# EAGLE design sirin-clone-mcu (EAGLE 9.3.1)
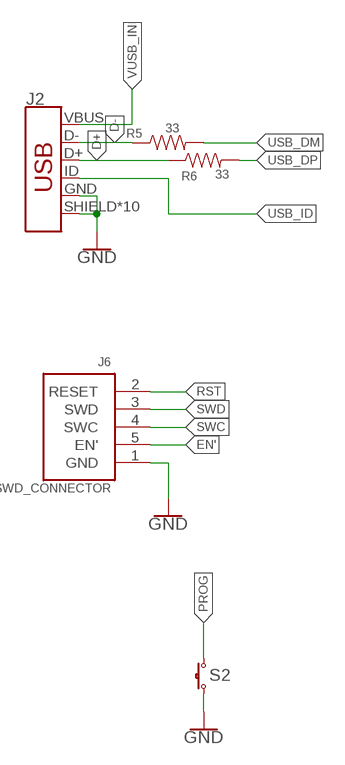
[diagram p0: schematic, sheet 1, part 1 of 2]
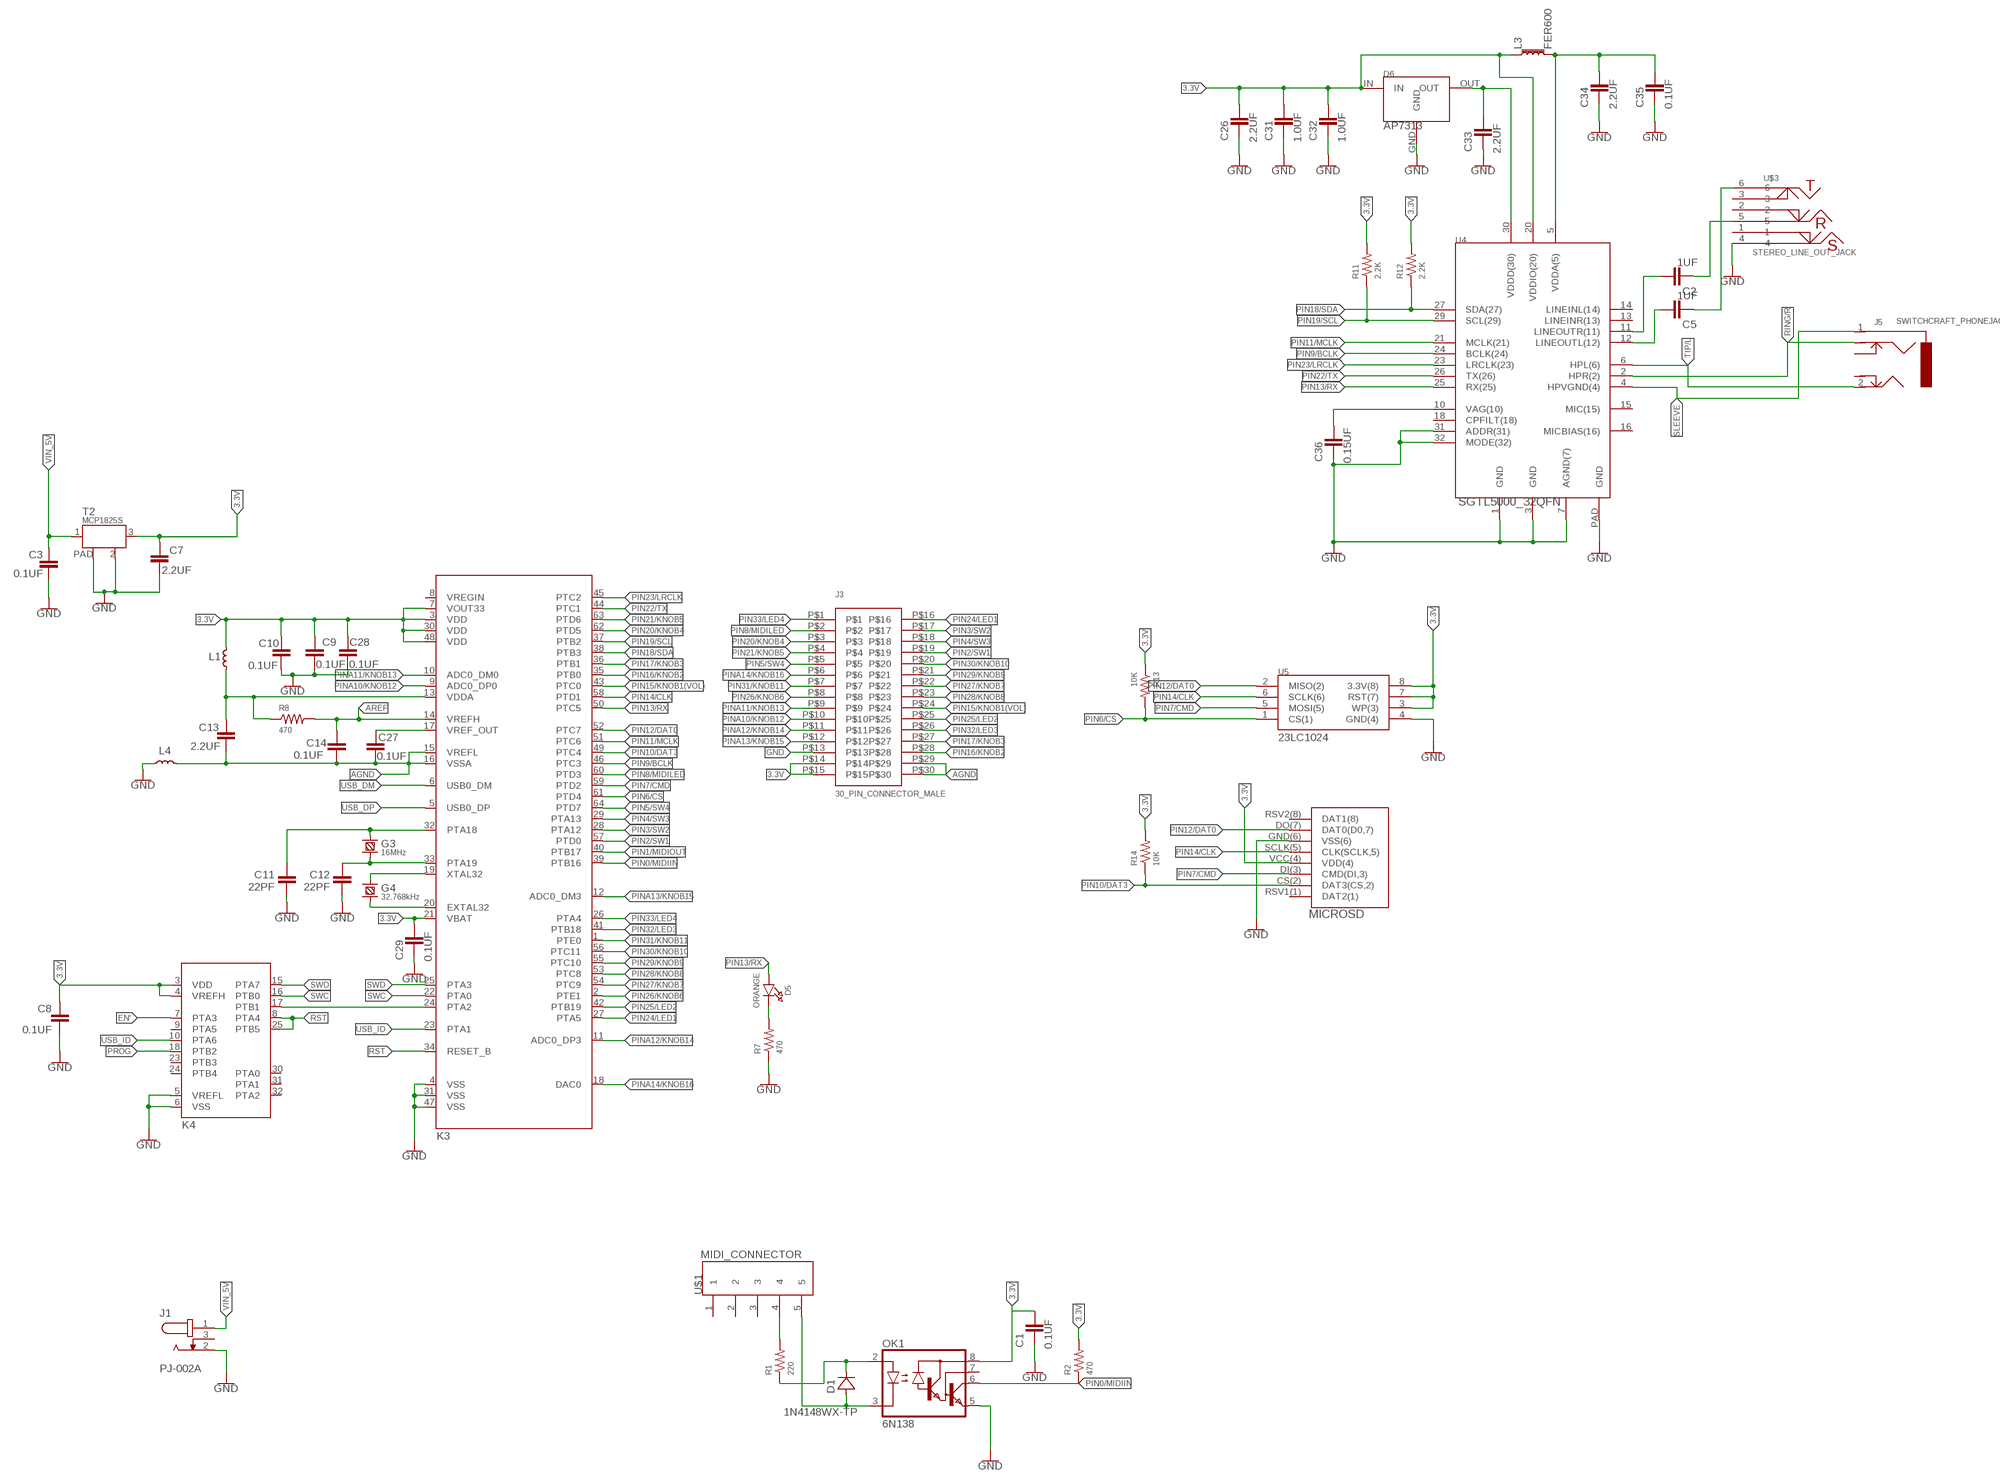
[diagram p1: schematic, sheet 1, part 2 of 2]

## Parts
C1  0.1UF  [C_0805]
C2  1UF  [C_0805]
C3  0.1UF  [C_0805]
C5  1UF  [C_0805]
C7  2.2UF  [C_0805]
C8  0.1UF  [C_0805]
C9  0.1UF  [C_0805]
C10  0.1UF  [C_0805]
C11  22PF  [C_0805]
C12  22PF  [C_0805]
C13  2.2UF  [C_0805]
C14  0.1UF  [C_0805]
C26  2.2UF  [C_0805]
C27  0.1UF  [C_0805]
C28  0.1UF  [C_0805]
C29  0.1UF  [C_0805]
C31  1.0UF  [C_0805]
C32  1.0UF  [C_0805]
C33  2.2UF  [C_0805]
C34  2.2UF  [C_0805]
C35  0.1UF  [C_0805]
C36  0.15UF  [C_0805]
D1  1N4148WX-TP  [SOD323]
D5  ORANGE  LED_ORANGE0805  [CHIPLED_0805]
D6  AP7313  [SOT23-3]
G3  16MHz  CRYSTAL-HC49US  [HC49US]
G4  32.768kHz  CRYSTAL-TC26H  [TC26H]
J1  PJ-002A  [CUI_PJ-002A]
J2  USB_MICRO-B_HALF_PTH_MILL  [USB-MICROB-PTH-MILL]
J3  30_PIN_CONNECTOR_MALE  [MOLEX_30PINCONNECTOR_2MM]
J5  SWITCHCRAFT_PHONEJACK  [STEREO_JACK_2SWITCH]
J6  SWD_CONNECTOR  [1X5HEADER]
K3  MK20DX256VLH7  [LQFP64-05]
K4  MKL04Z32VLC4  [LQFP32-08]
L1  FERRITE600_TEENSY  [L0603]
L3  FER600  FERRITE600  [0805]
L4  FERRITE600_TEENSY  [L0603]
OK1  6N138  [DIP8]
R1  220  220OHM  [0805]
R2  470  470OHM  [0805]
R5  33  33OHM  [0805]
R6  33  33OHM  [0805]
R7  470  470OHM  [0805]
R8  470  470OHM  [0805]
R11  2.2K  2.2KOHM  [0805]
R12  2.2K  2.2KOHM  [0805]
R13  10K  10KOHM  [0805]
R14  10K  10KOHM  [0805]
S2  TACT_SWITCH  [SWITCH_PTS820]
T2  MCP1825S  LDO  [SOT-223]
U4  SGTL5000_32QFN  [QFN-32-5MM]
U5  23LC1024  [TSSOP8]
U$1  MIDI_CONNECTOR  [DIN_SDS_50J]
U$3  STEREO_LINE_OUT_JACK  [AMPHENOL_STEREO_JACK]
U$6  MICROSD  [MICRO-SD-SOCKET]

## Nets
3.3V: C1.+ C7.+ C8.+ C9.+ C10.+ C26.+ C28.+ C29.+ C31.+ C32.+ D6.IN J3.P$14 J3.P$15 K3.3(VDD) K3.7(VOUT33) K3.21(VBAT) K3.30(VDD) K3.48(VDD) K4.3(VDD) K4.4(VREFH) L1.2 L3.1 OK1.8(VCC) R2.2 R11.2 R12.2 R13.1 R14.2 T2.3(OUT) U4.20(VDDIO(20)) U5.3(WP(3)) U5.7(RST(7)) U5.8(3.3V(8)) U$6.VCC(4)(VDD(4))
AGND: C13.- C14.- C27.- J3.P$29 J3.P$30 K3.15(VREFL) K3.16(VSSA) L4.2
AREF: C14.+ K3.14(VREFH) R8.2
D+: J2.D+ R6.1
D-: J2.D- R5.1
EN': J6.5(EN') K4.7(PTA3)
GND: C1.- C3.- C7.- C8.- C9.- C10.- C11.- C12.- C26.- C28.- C29.- C31.- C32.- C33.- C34.- C35.- C36.- D6.GND J1.2 J2.GND J2.SHIELD J2.SHIELD2(SHIELD) J2.SHIELD3(SHIELD) J2.SHIELD4(SHIELD) J2.SHIELD5(SHIELD) J2.SHIELD6(SHIELD) J2.SHIELD7(SHIELD) J2.SHIELD8(SHIELD) J2.SHIELD9(SHIELD) J2.SHIELD10(SHIELD) J3.P$13 J6.1(GND) K3.4(VSS) K3.31(VSS) K3.47(VSS) K4.5(VREFL) K4.6(VSS) L4.1 OK1.5(GND) R7.1 S2.2 T2.2(GND) T2.PAD U4.1(GND) U4.3(GND) U4.7(AGND(7)) U4.31(ADDR(31)) U4.32(MODE(32)) U4.PAD(GND) U5.4(GND(4)) U$3.4 U$6.GND(6)(VSS(6))
N$1: D1.A OK1.3(C) U$1.5
N$2: R1.2 U$1.4
N$3: D1.C OK1.2(A) R1.1
N$5: C5.+ U4.12(LINEOUTL(12))
N$6: C2.+ U4.11(LINEOUTR(11))
N$7: C2.- U$3.5
N$8: K3.24(PTA2) K4.17(PTB1)
N$9: D5.C R7.2
N$10: G4.1 K3.20(EXTAL32)
N$11: G4.2 K3.19(XTAL32)
N$12: C12.+ G3.2 K3.33(PTA19)
N$13: C11.+ G3.1 K3.32(PTA18)
N$14: C13.+ K3.13(VDDA) L1.1 R8.1
N$15: C27.+ K3.17(VREF_OUT)
N$16: C5.- U$3.6
N$19: C36.+ U4.10(VAG(10))
N$20: C33.+ D6.OUT U4.30(VDDD(30))
N$21: C34.+ C35.+ L3.2 U4.5(VDDA(5))
PIN0/MIDIIN: K3.39(PTB16) OK1.6(VO) R2.1
PIN1/MIDIOUT: K3.40(PTB17)
PIN2/SW1: J3.P$19 K3.57(PTD0)
PIN3/SW2: J3.P$17 K3.28(PTA12)
PIN4/SW3: J3.P$18 K3.29(PTA13)
PIN5/SW4: J3.P$5 K3.64(PTD7)
PIN6/CS: K3.61(PTD4) R13.2 U5.1(CS(1))
PIN7/CMD: K3.59(PTD2) U5.5(MOSI(5)) U$6.DI(3)(CMD(DI,3))
PIN8/MIDILED: J3.P$2 K3.60(PTD3)
PIN9/BCLK: K3.46(PTC3) U4.24(BCLK(24))
PIN10/DAT3: K3.49(PTC4) R14.1 U$6.CS(2)(DAT3(CS,2))
PIN11/MCLK: K3.51(PTC6) U4.21(MCLK(21))
PIN12/DAT0: K3.52(PTC7) U5.2(MISO(2)) U$6.DO(7)(DAT0(D0,7))
PIN13/RX: D5.A K3.50(PTC5) U4.25(RX(25))
PIN14/CLK: K3.58(PTD1) U5.6(SCLK(6)) U$6.SCLK(5)(CLK(SCLK,5))
PIN15/KNOB1(VOL): J3.P$24 K3.43(PTC0)
PIN16/KNOB2: J3.P$28 K3.35(PTB0)
PIN17/KNOB3: J3.P$27 K3.36(PTB1)
PIN18/SDA: K3.38(PTB3) R12.1 U4.27(SDA(27))
PIN19/SCL: K3.37(PTB2) R11.1 U4.29(SCL(29))
PIN20/KNOB4: J3.P$3 K3.62(PTD5)
PIN21/KNOB5: J3.P$4 K3.63(PTD6)
PIN22/TX: K3.44(PTC1) U4.26(TX(26))
PIN23/LRCLK: K3.45(PTC2) U4.23(LRCLK(23))
PIN24/LED1: J3.P$16 K3.27(PTA5)
PIN25/LED2: J3.P$25 K3.42(PTB19)
PIN26/KNOB6: J3.P$8 K3.2(PTE1)
PIN27/KNOB7: J3.P$22 K3.54(PTC9)
PIN28/KNOB8: J3.P$23 K3.53(PTC8)
PIN29/KNOB9: J3.P$21 K3.55(PTC10)
PIN30/KNOB10: J3.P$20 K3.56(PTC11)
PIN31/KNOB11: J3.P$7 K3.1(PTE0)
PIN32/LED3: J3.P$26 K3.41(PTB18)
PIN33/LED4: J3.P$1 K3.26(PTA4)
PINA10/KNOB12: J3.P$10 K3.9(ADC0_DP0)
PINA11/KNOB13: J3.P$9 K3.10(ADC0_DM0)
PINA12/KNOB14: J3.P$11 K3.11(ADC0_DP3)
PINA13/KNOB15: J3.P$12 K3.12(ADC0_DM3)
PINA14/KNOB16: J3.P$6 K3.18(DAC0)
PROG: K4.18(PTB2) S2.1
RING/R: J5.3(RING(3)) U4.2(HPR(2))
RST: J6.2(RESET) K3.34(RESET_B) K4.8(PTA4) K4.25(PTB5)
SLEEVE [HPGND]: J5.1(SLEEVE(1)) U4.4(HPVGND(4))
SWC: J6.4(SWC) K3.22(PTA0) K4.16(PTB0)
SWD: J6.3(SWD) K3.25(PTA3) K4.15(PTA7)
TIP/L: J5.2(TIP(2)) U4.6(HPL(6))
USB_DM: K3.6(USB0_DM) R5.2
USB_DP: K3.5(USB0_DP) R6.2
USB_ID: J2.ID K3.23(PTA1) K4.10(PTA6)
VIN_5V: C3.+ J1.1 T2.1(IN)
VUSB_IN: J2.VBUS
Unconnected: J1.3 J5.4(TIPSWITCH(4)) J5.5(RINGSWITCH(5)) K3.8(VREGIN) K4.9(PTA5) K4.23(PTB3) K4.24(PTB4) K4.30(PTA0) K4.31(PTA1) K4.32(PTA2) OK1.7(VB) U4.13(LINEINR(13)) U4.14(LINEINL(14)) U4.15(MIC(15)) U4.16(MICBIAS(16)) U4.18(CPFILT(18)) U$1.1 U$1.2 U$1.3 U$3.1 U$3.2 U$3.3 U$6.RSV1(1)(DAT2(1)) U$6.RSV2(8)(DAT1(8))

## Library data of the parts
C1 = sirin-clone-library:0.1UF: https://www.digikey.com/product-detail/en/kemet/C0805C104Z3VACTU/399-9158-1-ND/3522676
C2 C5 = sirin-clone-library:1UF: https://www.digikey.com/product-detail/en/kemet/C0805C104Z3VACTU/399-9158-1-ND/3522676
C3 C8-C10 C14 C27-C29 C35 = moon-germs-v1_main:0.1UF: https://www.digikey.com/product-detail/en/kemet/C0805C104Z3VACTU/399-9158-1-ND/3522676
C7 C13 C26 C33 C34 = moon-germs-v1_main:2.2UF: https://www.digikey.com/product-detail/en/samsung-electro-mechanics/CL21B105KAFNNNE/1276-1066-1-ND/3889152
C11 C12 = moon-germs-v1_main:22PF
C31 C32 = moon-germs-v1_main:1.0UF: https://www.digikey.com/product-detail/en/samsung-electro-mechanics/CL21B105KAFNNNE/1276-1066-1-ND/3889152
C36 = moon-germs-v1_main:0.15UF: https://www.digikey.com/product-detail/en/wurth-electronics-inc/885012207073/732-7667-1-ND/5454294
D1 = sirin-clone-library:1N4148WX-TP: https://www.digikey.com/product-detail/en/micro-commercial-co/1N4148WX-TP/1N4148WXTPMSCT-ND/717312
D5 = moon-germs-v1_main:LED_ORANGE: LED 0603 - 0603 Surface Mount Package 2mA: Green LED - Low Power (3.9mcd, 2ma, 1.7Vf) - Digikey: 475-2709-2-ND Orange LED - Low Power (9.8mcd, 2ma, 1.8Vf) - Digikey: 475-1194-2-ND Red LED - Low Power (5mcd, 2ma, 1.8Vf) - Digikey: 475-1195-2-ND Yellow LED - Low Power (7mcd, 2ma, 1.8Vf) - Digikey: 475-1196-2-ND 5mA: Blue LED - Low Power (17mcd, 5ma, 2.9Vf) - Digikey: LNJ937W8CRACT-ND 0805 - 0805 Surface Mount Package 2mA: Red LED (8.8mcd, 2mA, 1.8Vf, Clear) - Low Power [Digikey: 475-2510-1-ND] Green LED (5mcd, 2mA, 1.8Vf, Clear) - Low Power [Digikey: 475-2730-1-ND] Yellow LED (11.3mcd, 2mA, 1.8Vf, Clear) - Low Power [Digikey: 475-2555-1-ND] 20mA: Red LED (104mcd, 20mA, Diffused) - LS R976 [Digikey: 475-1278-6-ND] Red LED (12mcd, 20mA, 2.0Vf, Clear) - APT2012EC [Digikey: 754-1128-1-ND] Green LED (15mcd, 20mA, 2.2Vf, Clear) - APT2012GC [Digikey: 754-1131-1-ND] Orange LED (160mcd, 20mA, 2.1Vf, Clear) - APT2012SECK [Digikey: 754-1130-1-ND] 1206 - 1206 Surface Mount Package Green LED (26mcd, 20mA, Diffused) - LG N971 [Digikey: 475-1407-6-ND] Red LED (15mcd, 20mA, Diffused) - LH N974 [Digikey: 475-1416-6-ND] Cree - Cree High-Power Surface Mount LEDs XPEBWT-L1-0000-00D50 - White 111lm 350mA 2.9Vf 6200K 110° XTEAWT-00-0000-00000LEE3 - White 114lm 350mA 2.85Vf 5000K 115° Everlight - Everlight 45-21 Series Surface Mount LEDs 45-21/QK2C-B2832AC2CB2/2T - Warm White 2000mcd 20mA 3.25Vf 3050K 120° 45-21/LK2C-B38452C4CB2/2T - Nuetral White 2000mcd 20mA 3.25Vf 4150K 120° 45-21/LK2C-B50634C6CB2/2T - Cold White 2200mcd 20mA 3.25Vf 5650K 120° PLCC2 Reverse Mount LS T77K-J1L2-1-0-2-R18-Z - Red 11.25mcd 2mA 1.8Vf 630nm 120° LO T77K-L1M2-24-Z - Orange 19.6mcd 2mA 1.8Vf 606nm 120° LY T77K-K2M1-26-Z - Yellow 15.7mcd 2mA 1.8Vf 587nm 120°
D6 = moon-germs-v1:AP7313: https://www.digikey.com/product-detail/en/diodes-incorporated/AP7313-33SRG-7/AP7313-33SRG-7DICT-ND/2270841
G3 = moon-germs-v1_main:CRYSTAL-; DESC: 16MHz / 18pF / 10ppm; MF: ABRACON; MPN: ABL-16.000MHz-B1U; OC_MOUSER: 815-ABL-16-B1U; PACKAGE: HC-49US; TYPE: Crystal
G4 = moon-germs-v1_main:CRYSTAL-; DESC: 32.768kHz / 12.5pF / 20ppm; MF: Citizen FineDevice; MPN: CFS206-32.768KDZF-UB; OC_MOUSER: 695-CFS206-327KF-U; PACKAGE: TC-26H; TYPE: Crystal
J1 = sirin-clone-library:PJ-002A: 2.0 mm Center Pin, 2.5 A, Right Angle, Through Hole, Dc Power Jack Connector; MANUFACTURER: CUI INC; STANDARD: Manufacturer recommendations
J2 = sirin-clone-library:USB_MICRO-B: USB Type Micro-B Connector Male/female and PTH/SMT variants SparkFun Products: SparkFun microB USB Breakout <https://www.sparkfun.com/products/12035> SparkFun USB microB Plug Breakout <https://www.sparkfun.com/products/10031> SparkFun ESP8266 Thing <https://www.sparkfun.com/products/13231>; PROD_ID: CONN-13711
J3 = sirin-clone-library:30_PIN_CONNECTOR_MALE: https://www.digikey.com/product-detail/en/amphenol-icc-fci/57202-G52-15LF/609-2628-ND/1090157
J5 = moon-germs-v1_main:SWITCHCRAFT_PHONEJACK
J6 = moon-germs-v1_main:SWD_CONNECTOR
K3 = moon-germs-v1_main:MK20DX256VLH7; DESC: MK20DX256VLH7; MF: NXP; MPN: MK20DX256VLH7; OC_MOUSER: 841-MK20DX256VLH7; PACKAGE: LQFP-64; TYPE: Microcontroller
K4 = moon-germs-v1_main:MKL04Z32VLC4; DESC: MKL04Z32VLC4 (preprogrammed); MF: PJRC; MPN: IC_MKL04Z32_TQFP32; PACKAGE: LQFP-32; TYPE: Microcontroller
L1 L4 = moon-germs-v1_main:FERRITE600_TEENSY; DESC: 600R / 100MHz; MF: Murata Electronics; MPN: BLM18AG601SN1D; OC_MOUSER: 81-BLM11A601S; PACKAGE: 0603; TYPE: Ferrite
L3 = moon-germs-v1_main:FERRITE600: https://www.digikey.com/product-detail/en/tdk-corporation/MPZ2012S601AT000/445-2206-1-ND/765104
OK1 = sirin-clone-library:6N138: https://www.digikey.com/product-detail/en/lite-on-inc/6N138S/160-1797-ND/1969181
R1 = sirin-clone-library:220OHM
R2 = sirin-clone-library:470OHM
R5 R6 = moon-germs-v1_main:33OHM
R7 R8 = moon-germs-v1_main:470OHM
R11 R12 = moon-germs-v1_main:2.2KOHM: https://www.digikey.com/product-detail/en/yageo/RC0805FR-072K2L/311-2.20KCRCT-ND/730623
R13 R14 = moon-germs-v1_main:10KOHM
S2 = moon-germs-v1_main:TACT_SWITCH
T2 = moon-germs-v1_main:LDO; DESC: 3.3V 500mA; MF: Microchip Technology; MPN: MCP1825S-3302E/DB; OC_MOUSER: 579-MCP1825S-3302EDB; PACKAGE: SOT-223-3; TYPE: Voltage regulator
U4 = moon-germs-v1_main:SGTL5000_32QFN: https://www.digikey.com/product-detail/en/nxp-usa-inc/SGTL5000XNAA3R2/SGTL5000XNAA3R2TR-ND/2186898
U5 = moon-germs-v1_main:23LC1024: https://www.digikey.com/product-detail/en/microchip-technology/23LC1024T-I-ST/23LC1024T-I-STCT-ND/5818676
U$1 = sirin-clone-library:MIDI_CONNECTOR: https://www.digikey.com/product-detail/en/cui-inc/SDS-50J/CP-2350-ND/97033
U$3 = sirin-clone-library:STEREO_LINE_OUT_JACK
U$6 = moon-germs-v1_main:MICROSD

## Net classes
1 HPGND: width 0.254 mm

## Board
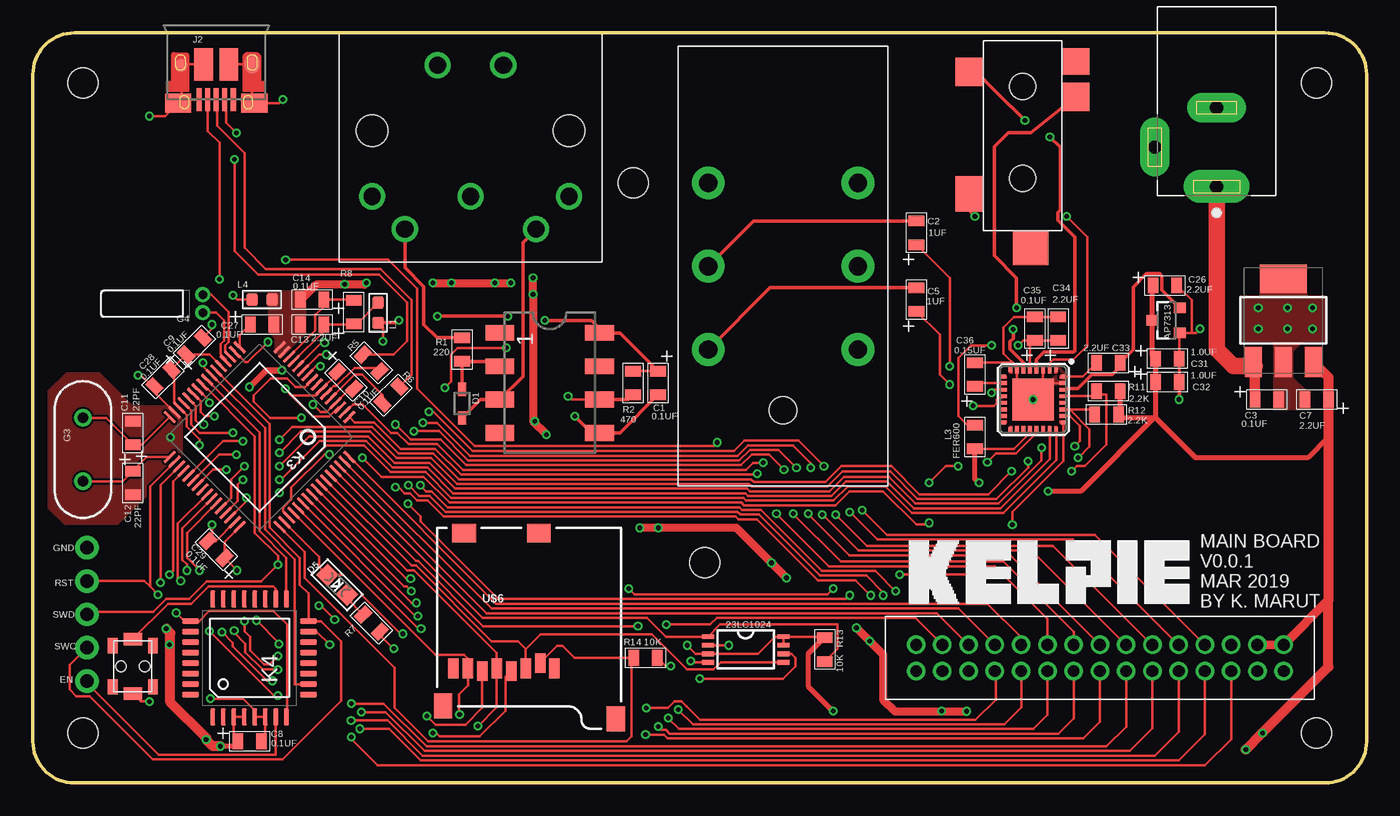
[diagram p2: board, top side]
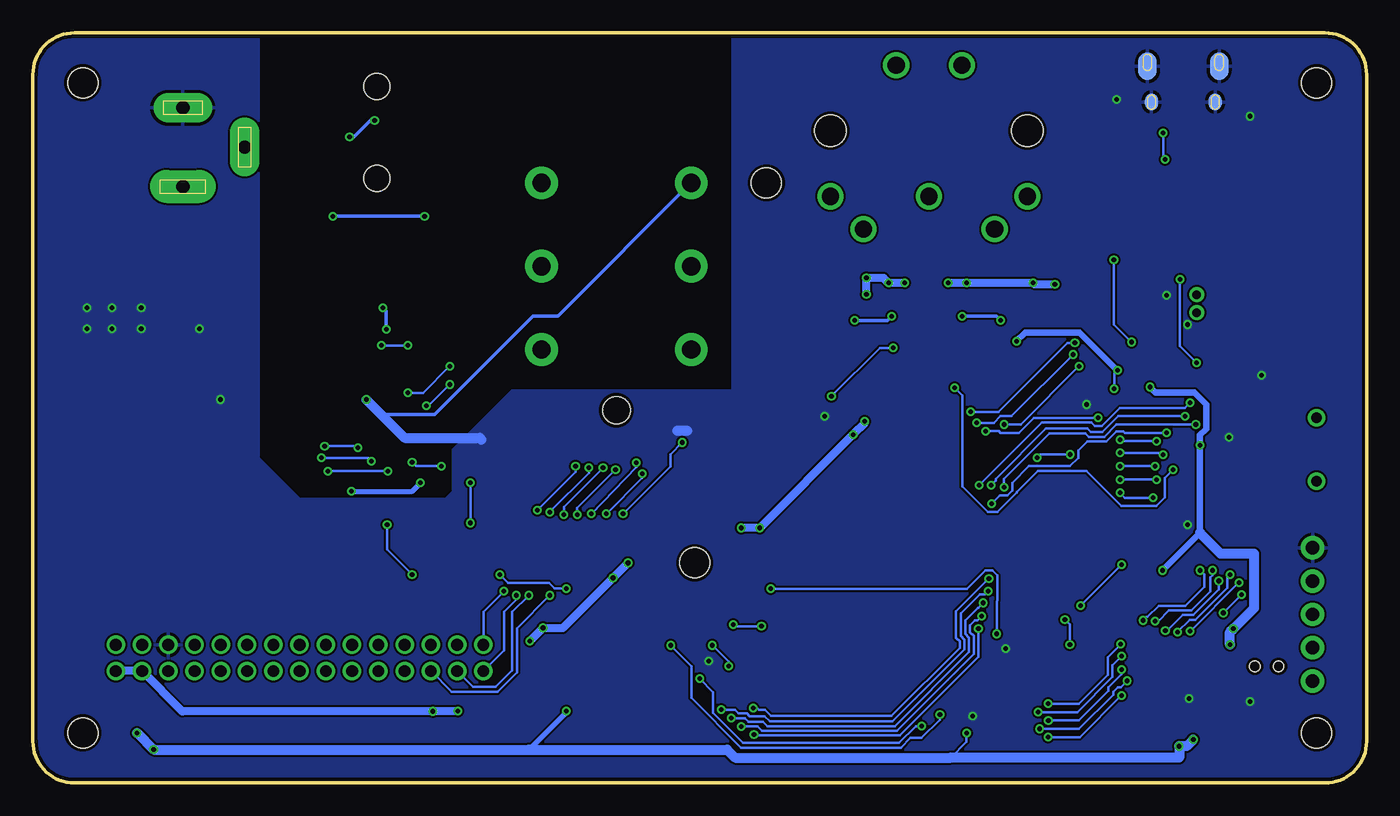
[diagram p3: board, bottom side, seen from below]

Size 101.6 x 57.15 mm. Coordinates in mm from the lower left corner, seen from the top.
Outline: 0,3.17 arc90 3.17,0 98.42,0 arc90 101.6,3.17 101.6,53.98 arc90 98.42,57.15 3.17,57.15 arc90 0,53.98 0,3.17
Copper layers (1*16): Top 0.035mm / dielectric 1.5mm / Bottom 0.035mm
Design rules "SeeedStudio_2layer_DRU_no_angle_20140221": minimum track width 6mil, minimum drill 12mil, track to track 6mil, track to pad 6mil, pad to pad 6mil, via to via 6mil, smd to smd 0mil, copper to edge 10mil, drill to drill 10mil, minimum pad ring 10mil, minimum via ring 6mil, stop-mask expansion 2mil, vias tented up to drill 100mil, thermal gap 10mil
Holes 2.3 mm at 45.72,45.72 97.79,53.34 97.79,3.81 51.18,16.76 3.81,53.34 3.81,3.81

### Footprints (pad centres in the part's own frame; a part is rotated, then mirrored left to right if it is on the bottom)
C_0805 = smd 0.8 x 1.2: + -0.9,0; - 0.9,0
SOD323 = smd 1 x 0.6: A 1.1,0; C -1.1,0
CHIPLED_0805 = smd 1.2 x 1.2: A 0,-1.05; C 0,1.05
SOT23-3 = smd 0.8 x 0.9: GND -0.95,-1; IN 0,1.1; OUT 0.95,-1
HC49US = drill 0.813: 1 -2.413,0; 2 2.413,0
TC26H = drill 0.635: 1 -0.686,0; 2 0.686,0
CUI_PJ-002A = drill 1 pad 2.5 long: 1 0,0 | drill 1 pad 2.25 long: 2 6,0; 3 3,4.7
USB-MICROB-PTH-MILL = smd 0.4 x 1.75: D+ 0,0; D- -0.65,0; GND 1.3,0; ID 0.65,0; VBUS -1.3,0 | smd 2 x 1.46: SHIELD -2.9,0.275; SHIELD2 2.9,0.275 | smd 1.425 x 2.5: SHIELD3 -0.963,-2.675; SHIELD4 0.963,-2.675 | smd 1.4 x 2.1 bottom: SHIELD5 -2.731,-2.531; SHIELD7 2.729,-2.531 | smd 1 x 1: SHIELD6 2.7,-2.575 | smd 1.1 x 1.5: SHIELD8 -2.731,-2.731 | smd 1 x 1.3 bottom: SHIELD9 -2.43,0.195; SHIELD10 2.43,0.195
MOLEX_30PINCONNECTOR_2MM = drill 0.9: P$1 -14,1; P$2 -12,1; P$3 -10,1; P$4 -8,1; P$5 -6,1; P$6 -4,1; P$7 -2,1; P$8 0,1; P$9 2,1; P$10 4,1; P$11 6,1; P$12 8,1; P$13 10,1; P$14 12,1; P$15 14,1; P$16 -14,-1; P$17 -12,-1; P$18 -10,-1; P$19 -8,-1; P$20 -6,-1; P$21 -4,-1; P$22 -2,-1; P$23 0,-1; P$24 2,-1; P$25 4,-1; P$26 6,-1; P$27 8,-1; P$28 10,-1; P$29 12,-1; P$30 14,-1
STEREO_JACK_2SWITCH = smd 2.2 x 2.1: 1 2.4,-1.05; 2 4.3,7.05 | smd 2.7 x 2.1: 3 11.7,-1.05 | smd 2 x 2.1: 4 1.6,7.05 | smd 2.6 x 2.7: 5 15.8,3.6 | hole 2: 10.5,3; 3.5,3
1X5HEADER = drill 1.016 pad 1.778: 1 0,0; 2 2.54,0; 3 5.08,0; 4 7.62,0; 5 10.16,0
LQFP64-05 = smd 1.2 x 0.25: 1 -5.915,3.759; 2 -5.915,3.251; 3 -5.915,2.743; 4 -5.915,2.261; 5 -5.915,1.753; 6 -5.915,1.245; 7 -5.915,0.762; 8 -5.915,0.254; 9 -5.915,-0.254; 10 -5.915,-0.762; 11 -5.915,-1.245; 12 -5.915,-1.753; 13 -5.915,-2.261; 14 -5.915,-2.743; 15 -5.915,-3.251; 16 -5.915,-3.759; 33 5.915,-3.759; 34 5.915,-3.251; 35 5.915,-2.743; 36 5.915,-2.261; 37 5.915,-1.753; 38 5.915,-1.245; 39 5.915,-0.762; 40 5.915,-0.254; 41 5.915,0.254; 42 5.915,0.762; 43 5.915,1.245; 44 5.915,1.753; 45 5.915,2.261; 46 5.915,2.743; 47 5.915,3.251; 48 5.915,3.759 | smd 0.25 x 1.2: 17 -3.759,-5.915; 18 -3.251,-5.915; 19 -2.743,-5.915; 20 -2.261,-5.915; 21 -1.753,-5.915; 22 -1.245,-5.915; 23 -0.762,-5.915; 24 -0.254,-5.915; 25 0.254,-5.915; 26 0.762,-5.915; 27 1.245,-5.915; 28 1.753,-5.915; 29 2.261,-5.915; 30 2.743,-5.915; 31 3.251,-5.915; 32 3.759,-5.915; 49 3.759,5.915; 50 3.251,5.915; 51 2.743,5.915; 52 2.261,5.915; 53 1.753,5.915; 54 1.245,5.915; 55 0.762,5.915; 56 0.254,5.915; 57 -0.254,5.915; 58 -0.762,5.915; 59 -1.245,5.915; 60 -1.753,5.915; 61 -2.261,5.915; 62 -2.743,5.915; 63 -3.251,5.915; 64 -3.759,5.915
LQFP32-08 = smd 1.3 x 0.4: 1 -4.493,2.8; 2 -4.493,2; 3 -4.493,1.2; 4 -4.493,0.4; 5 -4.493,-0.4; 6 -4.493,-1.2; 7 -4.493,-2; 8 -4.493,-2.8; 17 4.493,-2.8; 18 4.493,-2; 19 4.493,-1.2; 20 4.493,-0.4; 21 4.493,0.4; 22 4.493,1.2; 23 4.493,2; 24 4.493,2.8 | smd 0.4 x 1.3: 9 -2.8,-4.493; 10 -2,-4.493; 11 -1.2,-4.493; 12 -0.4,-4.493; 13 0.4,-4.493; 14 1.2,-4.493; 15 2,-4.493; 16 2.8,-4.493; 25 2.8,4.493; 26 2,4.493; 27 1.2,4.493; 28 0.4,4.493; 29 -0.4,4.493; 30 -1.2,4.493; 31 -2,4.493; 32 -2.8,4.493
L0603 = smd 0.889 x 0.889: 1 -0.762,0; 2 0.762,0
0805 = smd 0.8 x 1.2: 1 -0.9,0; 2 0.9,0
DIP8 = smd 1.2 x 2.2: 1 -3.81,-3.8; 2 -1.27,-3.8; 3 1.27,-3.8; 4 3.81,-3.8; 5 3.81,3.8; 6 1.27,3.8; 7 -1.27,3.8; 8 -3.81,3.8
SWITCH_PTS820 = smd 0.95 x 1.4: 1 -2.075,0; 2 2.075,0 | smd 1.15 x 0.75: PAD@1 -1.575,1.525; PAD@2 1.575,1.525; PAD@3 -1.575,-1.525; PAD@4 1.575,-1.525 | hole 0.8: 0,0.9; 0,-0.9
SOT-223 = smd 1.27 x 2.286: 1 -2.286,-3.175; 2 0,-3.175; 3 2.286,-3.175 | smd 3.556 x 2.159: PAD 0,3.175
QFN-32-5MM = smd 0.4 x 0.29: 1 -2.3,1.75; 8 -2.3,-1.75; 17 2.3,-1.75; 24 2.3,1.75 | smd 0.5 x 0.29: 2 -2.25,1.25; 3 -2.25,0.75; 4 -2.25,0.25; 5 -2.25,-0.25; 6 -2.25,-0.75; 7 -2.25,-1.25; 18 2.25,-1.25; 19 2.25,-0.75; 20 2.25,-0.25; 21 2.25,0.25; 22 2.25,0.75; 23 2.25,1.25 | smd 0.29 x 0.4: 9 -1.75,-2.3; 16 1.75,-2.3; 25 1.75,2.3; 32 -1.75,2.3 | smd 0.29 x 0.5: 10 -1.25,-2.25; 11 -0.75,-2.25; 12 -0.25,-2.25; 13 0.25,-2.25; 14 0.75,-2.25; 15 1.25,-2.25; 26 1.25,2.25; 27 0.75,2.25; 28 0.25,2.25; 29 -0.25,2.25; 30 -0.75,2.25; 31 -1.25,2.25 | smd 3.175 x 3.175: PAD 0,0
TSSOP8 = smd 0.9 x 0.35: 1 -2.875,0.975; 2 -2.875,0.325; 3 -2.875,-0.325; 4 -2.875,-0.975; 5 2.875,-0.975; 6 2.875,-0.325; 7 2.875,0.325; 8 2.875,0.975
DIN_SDS_50J = drill 1.3 pad 2: 1 7.5,10; 2 0,10; 3 -7.5,10; 4 5,12.5; 5 -5,12.5; P$1 -2.5,0; P$2 2.5,0 | hole 2.4: -7.5,5; 7.5,5
AMPHENOL_STEREO_JACK = drill 1.4 pad 2.5: 1 6.35,-5.7; 2 0,-5.7; 3 -6.35,-5.7; 4 6.35,5.7; 5 0,5.7; 6 -6.35,5.7 | hole 2.1: -10.98,0
MICRO-SD-SOCKET = smd 1.8 x 1.4: CD1 -2.05,0.4; CD2 -7.75,0.4 | smd 0.8 x 1.5: CS(2) -7.84,10.3; DI(3) -6.74,10.7; DO(7) -2.34,10.7; GND(6) -3.44,10.9; RSV1(1) -8.94,10.7; RSV2(8) -1.24,10.7; SCLK(5) -4.54,10.7; VCC(4) -5.64,10.9 | smd 1.4 x 1.9: GND1 -13.6,14.55; GND3 -0.45,13.55

### Placement (x,y rotation side)
C1  47.62,30.48 270 top
C2  67.31,41.91 90 top
C3  93.98,29.21 0 top
C5  67.31,36.83 90 top
C7  97.79,29.21 180 top
C8  16.51,3.17 0 top
C9  12.32,33.27 45 top
C10  23.84,30.68 315 top
C11  7.62,26.67 90 top
C12  7.62,22.86 270 top
C13  21.27,34.92 180 top
C14  21.27,36.83 180 top
C26  86.23,37.91 0 top
C27  17.46,34.92 0 top
C28  9.91,30.86 225 top
C29  13.97,17.78 135 top
C31  86.42,32.32 0 top
C32  86.42,30.54 0 top
C33  81.92,32 180 top
C34  78.11,34.61 90 top
C35  76.33,34.61 90 top
C36  71.75,31.11 90 top
D1  32.7,28.89 270 top
D5  23.18,15.1 225 top
D6  86.36,35.24 90 top
G3  3.81,25.4 270 top
G4  12.95,36.51 90 top
J1  90.17,45.44 90 top
J2  13.97,52.07 180 top
J3  81.28,9.53 0 top
J5  72.39,56.57 270 top
J6  4.12,17.92 270 top
K3  17.28,26.35 225 top
K4  16.51,9.53 90 top
L1  26.3,35.83 270 top
L3  71.75,26.35 90 top
L4  17.46,36.83 0 top
OK1  39.37,30.48 270 top
R1  32.7,33.02 90 top
R2  45.72,30.48 90 top
R5  25.78,32 315 top
R6  27.27,29.55 225 top
R7  25.79,12.18 135 top
R8  24.45,35.88 90 top
R11  81.92,29.84 0 top
R12  81.79,28.07 0 top
R13  60.33,10.16 270 top
R14  46.67,9.53 0 top
S2  7.62,8.89 270 top
T2  95.25,35.24 0 top
U4  76.2,29.21 270 top
U5  54.29,10.16 0 top
U$1  33.34,54.69 180 top
U$3  57.15,39.37 90 top
U$6  30.8,19.43 180 top

### Tracks (layer width: path | path; a pad name or v marks a point on that pad's centre or on a via)
3.3V  (via drill 0.35)
  Top 0.203: K3.21 13.47,32.64 C9.+ C28.+ 10.76,31.28 10.76,28.99 K3.30 11.71,28.04 11.71,27.16 12.7,26.17 v12.7,25.72 | K3.48 14.61,18.37 C29.+ v15.56,16.19 | C10.+ 23.2,31.2 K3.7 21.53,29.53 19.68,29.53 | C8.+ 15.31,3.48 K4.3 K4.4 | R13.1 60.25,11.13 U5.8 | U5.8 U5.7 | U5.8 56.54,11.13 55.24,9.84 U5.3 50.49,9.84 v49.85,10.48 | L3.1 74.73,25.45 75.95,26.67 U4.20 | v48.58,8.91 48.19,8.91 R14.2 | U$6.VCC(4) 35.99,8.09 35.99,5.51 34.04,3.56 30.99,3.56 30.74,3.81 v30.48,3.81 | v15.56,16.19 | K3.3 23.25,28.59 22.56,27.9 21.31,27.9 19.68,29.53 | L1.2 26.67,34.7 v26.67,33.66 | 19.68,29.53 v19.24,30.03 | R2.2 47.57,31.38 47.6,31.41
  Top 0.254: OK1.8 43.5,34.29 | 43.5,34.29 44.72,34.29 47.6,31.41 C1.+ | L1.2 27.7,35.06 v27.87,35.24 | v30.8,35.56 v36.2,35.56 | v38.99,35.24 42.55,35.24 43.5,34.29
  Top 0.381: 98.69,26.35 97.1,24.77 88.58,24.77 85.53,27.81 | 85.53,27.81 85.53,27.94 | 85.53,27.94 85.53,30.53 | C32.+ C31.+ 85.26,32.59 D6.IN 85.26,37.84 C26.+ | 85.53,27.81 82.94,27.81 R12.2 82.81,28.19 R11.2 | 85.53,27.94 79.82,22.23 v77.34,22.23 | v72.07,22.86 71.75,23.18 L3.1 | C8.+ 15.23,2.79 v14.29,2.79 | R13.1 60.27,11.06 59.05,9.84 59.05,7.37 v60.96,5.46
  Top 0.508: v16.51,30.16 17.78,31.43 v18.96,31.43
  Top 0.635: 98.69,13.94 J3.P$15 J3.P$14 | 85.53,30.53 C32.+
  Top 0.762: T2.3 98.69,30.91 C7.+ 98.69,26.35 98.69,13.94 98.69,8.84 v93.66,3.81 v92.39,2.54 | v10.16,11.75 10.48,11.43 10.48,6.16 13.21,3.43 v13.21,3.3 13.72,2.79 v14.29,2.79
  Bottom 0.203: v49.85,10.48 48.58,9.21 v48.58,8.91 | v30.48,3.81 30.48,3.13 31.69,1.92 | v19.24,30.03 19.24,31.19 19,31.43
  Bottom 0.254: v27.87,35.24 28.19,35.56 v30.8,35.56 | v36.2,35.56 36.51,35.24 v38.99,35.24
  Bottom 0.381: v77.34,22.23 72.71,22.23 v72.07,22.86 | 63.82,2.54 60.96,5.4 v60.96,5.46
  Bottom 0.508: v15.56,16.19 12.7,19.05 v12.7,25.72 12.7,26.51 12.23,26.98 12.23,28.84 13.14,29.74 16.09,29.74 v16.51,30.16 | v26.67,33.66 26.01,34.31 22.57,34.31 22.55,34.33 21.9,34.33 19,31.43 v18.96,31.43
  Bottom 0.762: v93.66,3.81 v92.39,2.54 63.82,2.54 48.72,2.54 48.11,1.92 31.69,1.92 14.29,1.92 v14.29,2.79 13.72,2.79 v13.21,3.3 | 12.7,19.05 11.11,17.46 8.57,17.46 8.57,13.34 v10.16,11.75 10.41,11.49 v10.41,10.54
AGND  (via drill 0.35)
  Top 0.61: C14.- 20.45,36.83 21.58,37.96 25.27,37.96 v25.4,38.09 | v30.48,38.1 v36.41,38.1 | v57.4,15.62 53.59,19.43 v46.23,19.43 | v39.12,26.54 38.11,27.55 v38.11,37.2 v38.1,37.21 v38.1,38.48 | v62.74,11.81 64.77,9.78 64.77,6.35 65.67,5.45 v71.12,5.45
  Bottom 0.254: v30.47,38.09 v30.48,38.1
  Bottom 0.61: v30.47,38.09 v25.4,38.09 25.28,37.97 v23.75,37.97 | v30.48,38.1 v31.88,38.1 | v35.18,38.1 v36.41,38.1 36.79,38.48 v38.1,38.48 v38.1,37.21 | J3.P$30 J3.P$29 90.21,5.45 v71.12,5.45 71.11,5.46 v69.22,5.46 | v38.23,27.56 38.23,27.43 v39.12,26.54 v46.23,19.43 v47.62,19.43 | v56.26,16.76 v57.4,15.62 61.21,11.81 v62.74,11.81 v63.75,10.79
  pour Top (no thermals): 17.91,37.08 17.91,34.42 18.41,33.91 18.41,32.89 18.92,32.38 20.83,34.29 20.83,37.47 17.91,37.47
AREF
  Top 0.203: R8.2 24.39,36.83 C14.+ 22.17,36.28 21.52,35.63 21.52,34.47 K3.14
D+
  Top 0.203: R6.1 28.86,31.13 28.86,36.8 26.5,39.16 17.74,39.16 16.13,40.77 16.13,47.98 14.04,50.07 14.04,52 J2.D+
D-  (via drill 0.35)
  Top 0.203: R5.1 27.49,32.64 28.51,33.66 28.51,36.58 26.36,38.72 17.14,38.72 15.37,40.5 v15.37,47.5 | J2.D- 14.73,51.96 14.73,50.29 v15.49,49.53
  Bottom 0.203: v15.49,49.53 15.49,47.62 v15.37,47.5
EN'
  Top 0.203: J6.5 4.12,7.63 9.59,2.16 18.51,2.16 K4.7
GND  (via drill 0.35)
  Top 0.152: U4.PAD 76.52,29.21 77.79,30.48 78.43,30.48 U4.31
  Top 0.203: K3.31 9.27,29.76 C28.- 9.08,30.23 8.26,31.05 v8,31.05 | K3.47 13.94,18.42 C29.- 13.65,18.73 v13.65,19.68 | C10.- 24.17,30.05 K3.4 22.38,28.26 21.91,28.26 v21.34,28.83 | v27.5,10.22 26.43,11.29 R7.1 | C8.- 17.71,3.48 K4.6 K4.5 16.91,5.54 16.04,6.41 v13.53,6.41 | S2.2 8.23,6.21 v8.89,6.21 | U4.7 74.98,31.49 74.98,31.69 74.65,32.02 C36.- | U4.7 74.95,31.71 73.93,32.73 73.93,34.7 74.74,35.51 C35.- C34.- | U5.4 50.19,9.19 v50.1,9.27 | U$6.GND(6) 34.24,5.73 32.95,4.44 30.68,4.44 30.04,5.08 v30.02,5.08 | U4.3 76.95,29.96 U4.PAD 74.95,30.46 U4.7 | C32.- C31.- 87.32,34.26 D6.GND 88.27,34.29 | C26.- 88.27,36.78 88.27,34.29 | 88.27,34.29 88.58,34.29 v88.9,34.61 | U4.32 79.97,30.96 C33.- | L4.1 15.56,36.83 v15.24,37.15 | C9.- 13.65,34.61 v13.65,34.92 | J2.SHIELD4 11.37,54.74 J2.SHIELD6 11.35,54.57 11.35,52.07 | J2.SHIELD3 16.64,54.74 J2.SHIELD8 16.7,51.96 J2.SHIELD 18.77,51.8 v19.05,52.07 | J2.GND 11.35,52.07 | 11.35,52.07 J2.SHIELD2 10.07,50.8 v8.89,50.8
  Top 0.254: v41.27,27.94 42.55,26.67 OK1.5 44.72,26.67 C1.- | C32.- v87.31,29.21
  Bottom 0.254: U$3.4 61.61,35.56 63.5,35.56 70.99,28.07 75.06,28.07 U4.PAD
  Bottom 0.762: U4.PAD 73.28,26.29 67.56,26.29 67.44,26.16 | 52.51,26.85 51.76,26.85
  other vias: 93.34,36.2 93.34,34.61 95.57,34.61 95.57,36.2 97.47,36.2 97.47,34.61 76.2,29.21 10.48,26.35
  pour Top (no thermals): 93.47,38.99 93.47,37.08 91.95,37.08 91.95,33.66 94.49,33.66 94.49,28.45 97.28,28.45 97.28,29.84 97.03,29.84 96.01,30.86 96.01,32.89 96.77,33.66 98.42,33.66 98.42,37.08 97.16,37.08 97.03,37.21 97.03,38.99
  pour Top (no thermals): 77.85,31.75 77.85,30.99 77.6,30.73 77.6,30.35 78.74,30.35 78.74,31.11 78.11,31.75
  pour Bottom: -0.64,57.78 48.26,57.78 48.26,29.84 65.09,29.84 69.53,25.4 69.53,22.23 70.17,21.59 81.28,21.59 84.45,24.77 84.45,57.78 84.77,58.1 100.33,58.1 102.55,55.88 102.55,1.27 100.46,-0.83 0.32,-0.83 -2.54,2.03 -2.54,55.56 -0.64,57.47
  pour Top (no thermals): 11.43,27.69 10.41,28.7 7.62,28.7 5.08,31.24 2.54,31.24 1.14,29.84 1.14,20.95 2.41,19.68 6.48,19.68 9.27,22.48 9.27,22.73 11.43,24.89
N$1
  Top 0.254: U$1.5 37.32,41.17 37.32,30.96 OK1.3 34.12,29.21 D1.A
N$2
  Top 0.254: R1.2 30.8,33.92 29.78,34.94 29.78,37.83 28.34,39.27 U$1.4
N$3
  Top 0.254: D1.C R1.1 35.2,32.12 OK1.2
N$5  (via drill 0.35)
  Top 0.203: C5.+ 69.09,34.15 69.09,31.11 v69.85,30.35 | v71.63,28.73 73.22,28.73 73.45,28.96 73.45,29.21 73.59,29.36 73.85,29.36 U4.12
  Bottom 0.203: v69.85,30.35 71.48,28.73 v71.63,28.73
N$6  (via drill 0.35)
  Top 0.203: C2.+ 69.85,38.47 v69.85,31.75 | v73.03,29.72 73.28,29.97 73.94,29.97 U4.11
  Bottom 0.203: v69.85,31.75 71.88,29.72 v73.03,29.72
N$7
  Top 0.254: U$3.5 54.89,42.81 C2.-
N$8
  Top 0.203: K3.24 17.27,26.72 17.27,19.2 19.31,17.16 K4.17
N$9
  Top 0.203: R7.2 23.92,14.05 D5.C
N$10
  Top 0.203: K3.20 14.69,32.28 14.3,32.67 14.3,33.45 14.57,33.72 14.57,35.24 13.98,35.83 G4.1
N$11
  Top 0.203: K3.19 14.66,32.85 14.66,33.31 14.92,33.57 14.92,35.88 13.6,37.2 G4.2
N$12
  Top 0.203: G3.2 6.85,22.99 C12.+ 8.69,24.83 K3.33
N$13
  Top 0.203: G3.1 5.58,27.81 C11.+ 8.33,25.77 K3.32
N$14
  Top 0.203: L1.1 24.69,34.98 R8.1 24.39,34.92 C13.+ 22.17,34.45 K3.13
N$15
  Top 0.203: K3.17 15.75,34.12 C27.+
N$16
  Top 0.254: U$3.6 56.16,37.73 C5.-
N$19
  Top 0.203: U4.10 72,30.46 C36.+
N$20
  Top 0.254: D6.OUT 86.01,37.54 86.01,38.62 85.85,38.79 84.82,38.79 83.82,37.79 83.82,33.01 C33.+ 82.81,31.7 82.23,31.11 80.67,31.11 79.58,30.04 78.82,30.04 78.74,29.96 U4.30
N$21  (via drill 0.35)
  Top 0.203: C35.+ 75.95,33.33 U4.5 | C34.+ 78.02,33.62 77.92,33.71 C35.+ | C35.+ 75.44,33.71 v75.07,33.34 | v73.03,33.34 71.44,33.34 70.48,32.38 70.48,27.94 71.17,27.25 L3.2
  Bottom 0.203: v75.07,33.34 v73.03,33.34
PIN0/MIDIIN  (via drill 0.35)
  Top 0.203: K3.39 13.72,23.88 v14.73,23.88 | v31.37,30.1 31.85,30.58 31.85,32.62 32.37,33.15 v36.07,33.15 | v40.77,29.46 41.02,29.21 43.31,29.21
  Top 0.254: R2.1 45.35,29.21 43.31,29.21 OK1.6
  Bottom 0.203: v14.73,23.88 15.37,23.24 15.37,21.73 16.02,21.09 18.68,21.09 21.37,23.77 25.04,23.77 26.64,22.18 26.64,22.13 28.13,20.64 28.84,20.64 30.8,22.61 30.8,29.53 v31.37,30.1 | v36.07,33.15 37.08,33.15 v40.77,29.46
PIN2/SW1  (via drill 0.35)
  Top 0.203: K3.57 28.42,15.57 v28.77,15.57 | v46.74,5.71 48.38,5.71 48.89,6.22 49.41,6.22 49.78,5.85 49.78,5.84 50.8,4.82 71.81,4.82 73.34,6.35 73.34,8.46 J3.P$19
  Bottom 0.203: v46.74,5.71 46.44,5.71 46.29,5.56 45.84,5.56 45.38,5.11 36.2,5.11 31,10.31 31,10.77 31.27,11.05 31.27,13.06 v28.77,15.57
PIN3/SW2  (via drill 0.35)
  Top 0.203: K3.28 12.42,28.73 12.42,27.62 12.74,27.3 v13.02,27.3 | v27.62,22.54 27.85,22.54 28.33,22.06 28.74,22.06 29.28,21.51 30.07,21.51 31.29,20.3 53.53,20.3 53.74,20.08 55.17,20.08 59.8,15.44 62.66,15.44 v63.82,14.29
  Bottom 0.203: v13.02,27.3 19.05,27.3 19.99,26.36 21.15,26.36 21.42,26.63 24.17,26.63 27.62,23.18 v27.62,22.54 | v63.82,14.29 65.09,13.02 65.09,8.57 66.36,7.3 68.06,7.3 J3.P$17
PIN4/SW3  (via drill 0.35)
  Top 0.203: K3.29 12.06,28.37 12.06,27.3 12.7,26.67 v15.24,26.67 | v28.57,21.27 29.53,20.32 29.53,19.92 35.44,14.01 61.95,14.01 v62.23,14.29
  Bottom 0.203: v15.24,26.67 18.41,26.67 18.53,26.79 19.06,26.79 19.84,26.01 21.27,26.01 21.97,25.31 21.97,24.76 22.6,24.13 25.72,24.13 26.99,22.86 26.99,22.28 27.36,21.91 27.94,21.91 v28.57,21.27 | v62.23,14.29 64.73,11.79 64.73,8.43 66.21,6.95 69.7,6.95 J3.P$18
PIN5/SW4
  Top 0.203: K3.64 35.29,13.65 72.71,13.65 75.28,11.08 J3.P$5
PIN6/CS
  Top 0.203: K3.61 34.25,12.57 46.8,12.57 48.24,11.13 U5.1 52.35,12.06 61.28,12.06 61.28,10.21 R13.2
PIN7/CMD
  Top 0.203: K3.59 28.84,16.55 29.18,16.55 34.94,10.79 36.96,10.79 37.54,10.21 37.54,10.18 | 37.54,10.18 U$6.DI(3) | U5.5 52.4,9.19 51.86,8.64 49.84,8.64 47.17,11.3 38.66,11.3 37.54,10.18
PIN8/MIDILED  (via drill 0.35)
  Top 0.203: K3.60 29.2,16.91 29.33,16.91 34.3,11.94 v46.1,11.94 | v48.26,12.06 51.59,12.06 52.1,12.57 67.23,12.57 J3.P$2
  Bottom 0.203: v46.1,11.94 48.13,11.94 v48.26,12.06
PIN9/BCLK  (via drill 0.35)
  Top 0.203: K3.46 16.28,21.48 v16.28,21.72 | v18.8,22.1 18.8,22.11 22.38,25.69 25.24,25.69 27.25,23.68 29.91,23.68 31.88,21.72 54.12,21.72 54.33,21.5 60.98,21.5 62.08,22.6 64.92,22.6 66.95,20.57 73.91,20.57 77.95,24.61 U4.24
  Bottom 0.203: v16.28,21.72 18.41,21.72 v18.8,22.1
PIN10/DAT3
  Top 0.203: K3.49 20.7,17.61 20.7,15.62 23.24,13.08 23.25,13.08 27.56,8.77 27.56,5.71 30.1,3.17 45.21,3.17 45.59,3.56 45.59,9.35 R14.1 41.27,9.53 40.36,10.44 39.94,10.44 38.61,9.11 38.61,9.1 U$6.CS(2)
PIN11/MCLK  (via drill 0.35)
  Top 0.203: U4.21 76.35,26.86 76.35,26.57 74.86,25.08 73.34,25.08 v72.71,24.45 | K3.51 19.05,20.7 19.05,20.97 19.68,21.6 19.68,22.5 22.21,25.02 v22.6,25.02 | v68.26,19.81 68.14,19.68 67.31,19.68 64.77,22.23 62.2,22.23 61.13,21.15 54.18,21.15 53.97,21.36 31.73,21.36 29.77,23.32 26.55,23.32 v25.09,24.78 | v68.26,22.86 69.53,24.13 v70.48,24.13
  Bottom 0.203: v72.71,24.45 72.39,24.13 v70.48,24.13 | v22.6,25.02 24.85,25.02 v25.09,24.78 | v68.26,19.81 v68.26,22.86
PIN12/DAT0  (via drill 0.35)
  Top 0.203: K3.52 30.67,9.76 32.85,9.76 33.25,9.37 33.25,8.84 U$6.DO(7) 33.14,7.42 32.46,6.74 32.46,5.25 v32.5,5.2 | v53.02,10.48 U5.2
  Bottom 0.203: v32.5,5.2 32.5,4.82 33.9,3.42 34.74,3.42 35.48,2.69 47.64,2.69 51.43,6.47 51.43,8.89 v53.02,10.48
PIN13/RX  (via drill 0.35)
  Top 0.203: K3.50 21.8,17.23 21.8,16.47 D5.A 23.65,15.84 25.03,14.46 25.03,14.34 28.02,11.36 v28.18,11.36 | U4.25 78.5,24.52 74.61,20.64 v74.61,19.68 | v66.04,15.88 v72.71,15.88 | v45.4,14.8 45.83,14.36 60.51,14.36 v60.96,14.81
  Bottom 0.203: v28.18,11.36 28.18,13.85 28.14,13.89 28.14,15.83 28.51,16.2 29.04,16.2 30.44,14.8 v45.4,14.8 | v60.96,14.81 61.86,14.81 62.29,15.24 65.4,15.24 v66.04,15.88 | v72.71,15.88 74.61,17.78 v74.61,19.68
PIN14/CLK  (via drill 0.35)
  Top 0.203: K3.58 28.51,16.2 29.04,16.2 35.34,9.9 U$6.SCLK(5) 35.34,5.75 v33.91,4.32 | v50.8,7.94 57.15,7.94 58.1,8.89 58.1,9.53 57.78,9.84 U5.6
  Bottom 0.203: v33.91,4.32 34.35,4.32 35.62,3.04 47.5,3.04 49.78,5.33 49.78,6.92 v50.8,7.94
PIN15/KNOB1(VOL)  (via drill 0.35)
  Top 0.203: K3.43 11.75,19.06 11.75,17.14 v12.7,16.19 | v24.26,6.03 26.74,6.03 29.98,2.79 81.78,2.79 83.28,4.29 J3.P$24 | v18.73,10.56 18.73,10.69 v17.04,12.38
  Bottom 0.203: v12.7,16.19 12.38,15.88 12.38,14.92 13.81,13.5 15.85,13.5 16.71,12.64 16.79,12.64 v17.04,12.38 | v18.73,10.56 19.72,9.57 19.72,8.22 21.91,6.03 v24.26,6.03
PIN16/KNOB2  (via drill 0.35)
  Top 0.203: K3.35 9.73,22.69 v9.73,15.26 | v24.25,3.48 24.25,3.36 26.27,1.33 89.28,1.33 91.28,3.33 J3.P$28 | v13.46,11.56 18.35,6.67 v18.68,6.67
  Bottom 0.203: v24.25,3.48 21.86,3.48 v18.68,6.67 | v9.73,15.26 13.44,11.56 v13.46,11.56
PIN17/KNOB3  (via drill 0.35)
  Top 0.203: K3.36 10.68,22.95 10.68,16.15 v10.4,15.88 | v24.9,4.12 27.14,4.12 29.54,1.72 87.31,1.72 89.28,3.69 J3.P$27 | v14.42,11.5 15.24,10.67 15.24,10.41 17.87,7.78 v18.26,7.78
  Bottom 0.203: v10.4,15.88 10.63,15.65 10.63,14.87 13.07,12.43 13.48,12.43 v14.42,11.5 | v24.9,4.12 21.92,4.12 19.31,6.73 19.31,6.93 18.94,7.3 18.74,7.3 v18.26,7.78
PIN18/SDA  (via drill 0.35)
  Top 0.203: K3.38 14.18,25.02 v15.49,25.02 | v18.8,25.15 20.41,26.76 25.69,26.76 27.7,24.75 30.36,24.75 32.32,22.78 54.56,22.78 54.77,22.57 60.54,22.57 61.69,23.72 65.31,23.72 67.39,21.64 73.41,21.64 75.82,24.05 v75.82,24.51 | v79.63,24.77 80.49,25.62 80.49,26.94 78.98,28.46 | 78.98,28.46 U4.27 | R12.1 80.5,28.46 78.98,28.46
  Bottom 0.203: v18.8,25.15 15.62,25.15 v15.49,25.02 | v75.82,24.51 76.07,24.77 v79.63,24.77
PIN19/SCL  (via drill 0.35)
  Top 0.203: K3.37 14.48,26.04 v16,26.04 | v18.8,26.16 19.75,27.11 25.85,27.11 27.86,25.1 30.5,25.1 32.46,23.14 54.71,23.14 54.92,22.93 60.39,22.93 61.59,24.13 65.41,24.13 67.54,22 72.8,22 v74.55,23.75 | v79.13,23.74 79.52,24.13 80.14,24.13 81.79,25.78 81.79,29.59 81.27,29.59 R11.1 80.63,29.46 U4.29
  Bottom 0.203: v16,26.04 18.67,26.04 v18.8,26.16 | v74.55,23.75 v79.12,23.75 v79.13,23.74
PIN20/KNOB4
  Top 0.203: K3.62 34.58,12.93 68.88,12.93 J3.P$3
PIN21/KNOB5
  Top 0.203: K3.63 34.94,13.28 70.52,13.28 J3.P$4
PIN22/TX  (via drill 0.35)
  Top 0.203: K3.44 15.11,21.71 15.11,23.11 v16.13,24.13 | v18.8,24.13 21.06,26.4 25.54,26.4 27.55,24.39 30.21,24.39 32.17,22.43 54.41,22.43 54.62,22.21 60.69,22.21 61.78,23.31 65.22,23.31 67.24,21.29 73.56,21.29 76.83,24.56 v76.83,25.53 | v79.38,25.65 79.76,26.04 79.76,27.18 78.97,27.96 U4.26
  Bottom 0.203: v16.13,24.13 v18.8,24.13 | v76.83,25.53 76.96,25.65 v79.38,25.65
PIN23/LRCLK  (via drill 0.35)
  Top 0.203: K3.45 15.62,21.5 15.62,22.73 v16,23.11 | v18.8,23.11 18.91,23.11 21.85,26.05 25.38,26.05 27.4,24.03 30.06,24.03 32.02,22.07 54.27,22.07 54.48,21.86 60.83,21.86 61.93,22.95 65.07,22.95 67.1,20.93 73.71,20.93 77.48,24.7 77.48,26.93 U4.23
  Bottom 0.203: v16,23.11 v18.79,23.11 v18.8,23.11
PIN24/LED1  (via drill 0.35)
  Top 0.203: K3.27 12.78,29.09 12.78,28.26 13.09,27.94 v13.84,27.94 v13.85,27.94 | v28.6,22.69 v28.61,22.69 29.43,21.87 30.21,21.87 31.43,20.65 53.67,20.65 53.89,20.44 55.32,20.44 59.96,15.8 63.5,15.8 64.77,14.53 v64.77,14.29
  Bottom 0.203: v13.85,27.94 18.91,27.94 20.14,26.72 21,26.72 21.27,26.99 24.45,26.99 28.26,23.18 28.26,23.03 v28.6,22.69 | v64.77,14.29 64.77,13.97 65.72,13.02 65.72,10.08 J3.P$16
PIN25/LED2  (via drill 0.35)
  Top 0.203: K3.42 11.39,19.39 11.39,17 11.75,16.64 v11.75,16.19 | v25.03,5.39 26.88,5.39 29.84,2.43 83.57,2.43 85.28,4.15 J3.P$25 | v16.13,12.32 16.13,11.56 16.55,11.14 16.55,10.11 17.61,9.04 18.06,9.04 v18.67,9.65
  Bottom 0.203: v11.75,16.19 11.75,15.8 11.9,15.65 11.9,14.61 13.36,13.14 15.06,13.14 15.88,12.32 v16.13,12.32 | v18.67,9.65 19.37,8.95 19.37,8.07 22.05,5.39 v25.03,5.39
PIN26/KNOB6  (via drill 0.35)
  Top 0.203: K3.2 23.79,28.24 24.38,28.83 25.14,28.83 27.3,26.67 27.75,26.67 28.61,25.81 30.8,25.81 32.76,23.85 54.33,23.85 54.86,24.38 v55.63,24.38 | v59.05,20.51 62.22,17.35 74.45,17.35 J3.P$8
  Bottom 0.203: v59.05,20.51 55.63,24.07 v55.63,24.38
PIN27/KNOB7  (via drill 0.35)
  Top 0.203: K3.54 29.17,12.7 v29.34,12.7 | v47.62,4.31 47.9,4.03 48.23,4.03 48.5,3.75 78.11,3.75 79.28,4.93 J3.P$22
  Bottom 0.203: v47.62,4.31 46.39,4.31 46.06,3.98 35.8,3.98 29.93,9.84 29.93,11.21 30.21,11.49 30.21,12.01 29.84,12.38 29.66,12.38 v29.34,12.7
PIN28/KNOB8  (via drill 0.35)
  Top 0.203: K3.53 29.4,11.75 29.53,11.75 v29.58,11.75 | v46.67,3.67 48.08,3.67 48.35,3.4 80.01,3.4 81.28,4.67 J3.P$23
  Bottom 0.203: v29.58,11.75 29.58,9.59 35.55,3.62 46.67,3.62 v46.67,3.67
PIN29/KNOB9  (via drill 0.35)
  Top 0.203: K3.55 28.84,13.72 v29.21,13.72 | v48.39,4.94 49.22,4.11 76.2,4.11 77.28,5.19 J3.P$21
  Bottom 0.203: v48.39,4.94 47.36,4.94 47.09,4.66 45.99,4.66 45.66,4.33 35.95,4.33 30.29,9.99 30.29,11.06 30.56,11.34 30.56,12.38 29.6,13.34 29.59,13.34 v29.21,13.72
PIN30/KNOB10  (via drill 0.35)
  Top 0.203: K3.56 28.28,14.99 28.46,14.99 v28.83,14.62 | v49.15,5.59 50.27,4.46 74,4.46 75.28,5.75 J3.P$20
  Bottom 0.203: v49.15,5.59 49.13,5.57 48.12,5.57 47.85,5.29 47.22,5.29 47,5.08 45.86,5.08 45.47,4.69 36.12,4.69 30.64,10.16 30.64,10.92 30.92,11.19 30.92,12.9 29.47,14.35 29.1,14.35 v28.83,14.62
PIN31/KNOB11  (via drill 0.35)
  Top 0.203: K3.1 24.52,27.47 25.99,27.47 28.01,25.46 30.65,25.46 32.61,23.5 55.12,23.5 v55.18,23.56 | J3.P$7 79.28,11.52 73.93,16.87 61.56,16.87 v57.91,20.51
  Bottom 0.203: v55.18,23.56 55.18,23.24 v57.91,20.51
PIN32/LED3  (via drill 0.35)
  Top 0.203: K3.41 11.04,19.75 11.04,15.62 v11.26,15.39 | v24.25,4.76 27.01,4.76 29.69,2.08 85.47,2.08 87.28,3.89 J3.P$26 | v15.34,11.59 15.34,11.46 16.19,10.6 16.19,9.96 17.5,8.65 v18.68,8.65
  Bottom 0.203: v24.25,4.76 21.91,4.76 19.67,7 19.67,7.27 18.68,8.26 v18.68,8.65 | v11.26,15.39 11.26,14.74 13.21,12.79 14.02,12.79 15.22,11.59 v15.34,11.59
PIN33/LED4  (via drill 0.35)
  Top 0.203: K3.26 13.46,29.09 v13.46,28.96 | v29.5,22.69 29.97,22.23 30.36,22.23 31.58,21.01 53.82,21.01 54.04,20.79 55.47,20.79 60.1,16.15 64.17,16.15 v65.72,14.61
  Bottom 0.203: v13.46,28.96 13.84,28.58 18.79,28.58 20.18,27.18 20.71,27.18 20.98,27.46 24.74,27.46 v29.5,22.69 | v65.72,14.61 67.28,13.05 J3.P$1
PINA10/KNOB12  (via drill 0.35)
  Top 0.203: v29.02,26.8 30.93,26.8 33.16,24.56 53.81,24.56 54.62,25.37 56.8,25.37 v58.17,24 | v61.15,20.45 63.53,18.06 77.71,18.06 85.25,10.53 J3.P$10 | K3.9 20.73,30.16 20,30.16 19.37,30.8 18.1,30.8 16.83,29.53 16.83,29.07 18.08,27.81 v20.45,27.81
  Bottom 0.203: v20.45,27.81 25.34,27.81 26.48,26.67 27.88,26.67 28.01,26.8 v29.02,26.8 | v61.15,20.45 61.15,21.02 v58.17,24
PINA11/KNOB13  (via drill 0.35)
  Top 0.203: K3.10 21.6,31.75 v21.91,31.75 | v57.21,23.88 56.07,25.02 54.77,25.02 53.95,24.21 33.02,24.21 31.06,26.17 28.76,26.17 v27.62,27.3 | v60.13,20.45 62.88,17.71 76.07,17.71 83.25,10.53 J3.P$9
  Bottom 0.203: v21.91,31.75 26.35,27.3 v27.62,27.3 | v60.13,20.45 60.13,20.95 v57.21,23.88
PINA12/KNOB14  (via drill 0.35)
  Top 0.203: K3.11 21.8,32.64 v22.35,32.64 | v29.72,27.43 30.8,27.43 33.31,24.92 53.66,24.92 54.47,25.73 57.9,25.73 59.24,24.38 v59.24,24 | v62.23,20.64 64.33,18.54 79.23,18.54 87.25,10.53 J3.P$11
  Bottom 0.203: v22.35,32.64 27.05,27.94 27.88,27.94 28.39,27.43 v29.72,27.43 | v59.24,24 59.24,23.62 v62.23,20.64
PINA13/KNOB15  (via drill 0.35)
  Top 0.203: K3.12 21.99,33.55 v22.23,33.55 | v30.17,28.27 30.54,28.27 33.5,25.3 53.41,25.3 54.2,26.08 58.31,26.08 v60.26,24.13 | v63.18,20.77 65.05,18.9 80.91,18.9 J3.P$12
  Bottom 0.203: v22.23,33.55 22.25,33.52 22.8,33.52 28.06,28.27 v30.17,28.27 | v63.18,20.77 60.26,23.69 v60.26,24.13
PINA14/KNOB16  (via drill 0.35)
  Top 0.203: K3.18 16.16,32.07 16.38,32.07 v17.91,33.59 | v56.64,20.51 60.64,16.51 73.28,16.51 77.28,12.51 J3.P$6 | v52.13,25.93 51.88,25.68 33.66,25.68 29.28,30.06 29.28,37.65 27.07,39.86 v19.25,39.86
  Bottom 0.203: v17.91,33.59 19.25,34.94 v19.25,39.86 | v52.13,25.93 53.02,25.04 53.02,24.13 v56.64,20.51
PROG
  Top 0.203: K4.18 18.51,14.76 18.29,14.99 13.4,14.99 12.06,13.65 10.31,13.65 S2.1
RING/R  (via drill 0.35)
  Top 0.203: U4.2 77.47,31.48 77.47,32 77.72,32.26 79.25,32.26 80.33,33.34 80.33,41.59 v78.74,43.18
  Top 0.254: v71.75,43.18 71.34,43.59 J5.3
  Bottom 0.254: v78.74,43.18 v71.75,43.18
RST  (via drill 0.35)
  Top 0.203: J6.2 8.5,15.38 8.92,14.95 | 8.92,14.95 v9.53,14.35 | v10.92,12.95 11.55,12.32 K4.25 12.66,12.32 13.45,13.11 18.32,13.11 19.37,12.06 19.37,5.09 K4.8 | K3.34 8.92,22.6 8.92,14.95
  Bottom 0.203: v10.92,12.95 v9.53,14.35
SLEEVE  (via drill 0.35)
  Top 0.254: v77.47,49.21 78.25,48.43 78.25,43.62 78.08,43.45 78.08,42.88 79.38,41.59 79.38,32.92 79.26,32.81 77.01,32.81 76.45,32.25 U4.4 | v75.56,50.48 74.54,51.51 74.5,51.51 71.34,54.67 J5.1
  Bottom 0.254: v77.47,49.21 77.15,49.21 75.88,50.48 v75.56,50.48
SWC
  Top 0.203: K3.22 18.03,27.36 18.03,19.45 20.34,17.15 20.34,15.1 21,14.43 K4.16 21.96,12.32 23.5,10.79 23.5,6.26 19.04,1.8 9.12,1.8 4.32,6.6 3.3,6.6 2.79,7.11 2.79,8.98 J6.4
SWD  (via drill 0.35)
  Top 0.203: K3.25 12.97,30.36 16.92,26.41 16.92,19.05 18.67,17.3 v18.67,16.64 17.37,15.34 13.25,15.34 11.92,14.01 10.16,14.01 9.17,13.02 4.29,13.02 J6.3 | v21.77,13.52 21.91,13.52 v22.99,12.45 | v22.61,10.54 21.62,11.53 K4.15
  Bottom 0.203: v21.77,13.52 18.67,16.63 v18.67,16.64 | v22.99,12.45 22.61,12.06 v22.61,10.54
TIP/L  (via drill 0.35)
  Top 0.254: U4.6 75.45,32.02 74.41,33.06 74.41,33.61 74.67,33.87 v74.67,34.55 | J5.2 76.02,49.53 74.3,49.53 73.25,48.48 73.25,40.16 74.93,38.48 v74.93,36.2
  Bottom 0.254: v74.67,34.55 74.67,35.94 v74.93,36.2
USB_DM
  Top 0.203: K3.6 22.91,30.23 23.11,30.23 24.51,31.62 26.16,31.62 R5.2
USB_DP
  Top 0.203: K3.5 24.52,31.11 25.08,31.11 26.64,29.56 R6.2
USB_ID  (via drill 0.35)
  Top 0.203: K4.10 19.94,7.53 19.94,17.04 17.68,19.3 17.68,27.03 K3.23 12.95,31.75 v12.95,32 | v14.22,38.35 14.22,48.77 13.32,49.67 J2.ID
  Bottom 0.203: v14.22,38.35 14.22,35.18 14.23,35.17 14.23,33.28 v12.95,32
VIN_5V
  Top 0.508: 93.08,31.75 93.08,31.95 T2.1
  Top 0.813: C3.+ 93.08,31.75
  Top 1.27: J1.1 90.17,33.02 91.44,31.75 93.08,31.75

### Text on the board
tPlace: GND | RST | SWD | MAIN BOARD / V0.0.1 / MAR 2019 / BY K. MARUT | SWC | EN